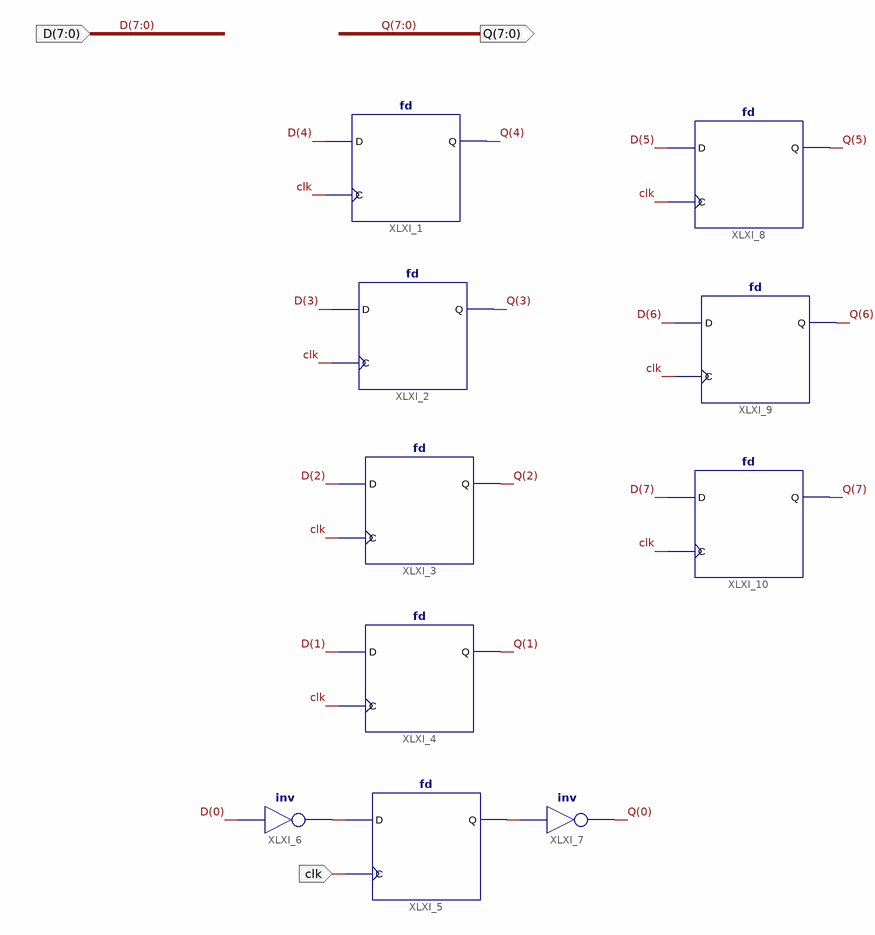
[diagram p0: schematic sheet 1]
// Xilinx ISE schematic ff5.sch (spartan3e) as structural Verilog: 10 symbols, 3 ports
module ff5 (
  input  clk,
  input  [7:0] D,
  output [7:0] Q
);

  wire XLXN_10, XLXN_15;

  fd XLXI_1 (.C(clk), .D(D[4]), .Q(Q[4]));
  fd XLXI_2 (.C(clk), .D(D[3]), .Q(Q[3]));
  fd XLXI_3 (.C(clk), .D(D[2]), .Q(Q[2]));
  fd XLXI_4 (.C(clk), .D(D[1]), .Q(Q[1]));
  fd XLXI_5 (.C(clk), .D(XLXN_10), .Q(XLXN_15));
  not XLXI_6 (XLXN_10, D[0]);
  not XLXI_7 (Q[0], XLXN_15);
  fd XLXI_8 (.C(clk), .D(D[5]), .Q(Q[5]));
  fd XLXI_9 (.C(clk), .D(D[6]), .Q(Q[6]));
  fd XLXI_10 (.C(clk), .D(D[7]), .Q(Q[7]));
endmodule
